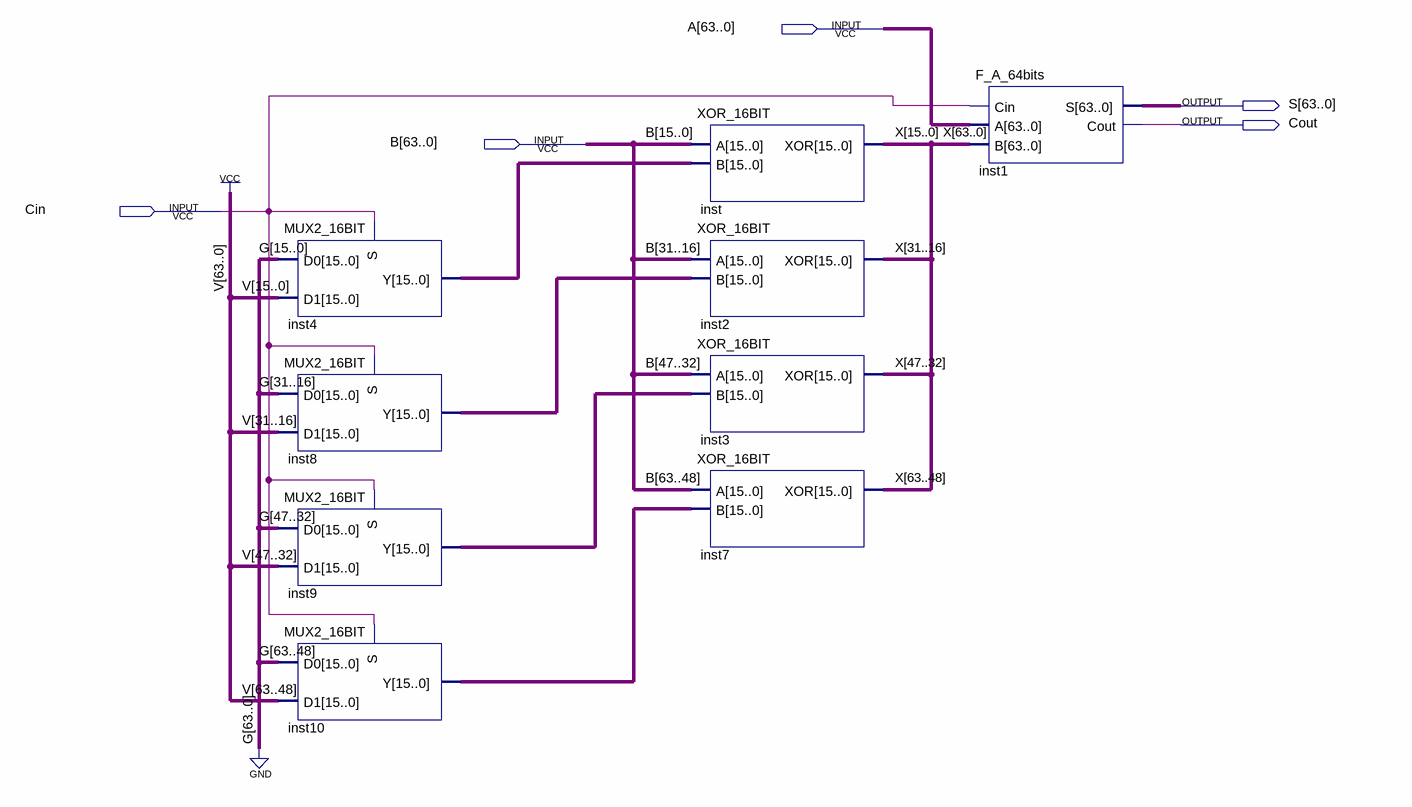
[diagram p0: schematic sheet]
// Quartus schematic ADD_SUB_64bits.bdf as structural Verilog: 9 symbols, 5 pins
module ADD_SUB_64bits (
  input  [63:0] A,
  input  [63:0] B,
  input  Cin,
  output [63:0] S,
  output Cout
);

  wire [15:0] inst4_y, inst8_y, inst9_y, inst10_y;
  wire [63:0] X;

  MUX2_16BIT inst4 (.S(Cin), .D1({16{1'b1}}), .D0({16{1'b0}}), .Y(inst4_y));
  MUX2_16BIT inst8 (.S(Cin), .D1({16{1'b1}}), .D0({16{1'b0}}), .Y(inst8_y));
  MUX2_16BIT inst9 (.S(Cin), .D1({16{1'b1}}), .D0({16{1'b0}}), .Y(inst9_y));
  MUX2_16BIT inst10 (.S(Cin), .D1({16{1'b1}}), .D0({16{1'b0}}), .Y(inst10_y));
  XOR_16BIT inst (.A(B[15:0]), .B(inst4_y), .XOR(X[15:0]));
  XOR_16BIT inst2 (.A(B[31:16]), .B(inst8_y), .XOR(X[31:16]));
  XOR_16BIT inst3 (.A(B[47:32]), .B(inst9_y), .XOR(X[47:32]));
  XOR_16BIT inst7 (.A(B[63:48]), .B(inst10_y), .XOR(X[63:48]));
  F_A_64bits inst1 (.Cin(Cin), .A(A), .B(X), .S(S), .Cout(Cout));
endmodule
